# Altium schematic sheet DMB.SchDoc
size Letter
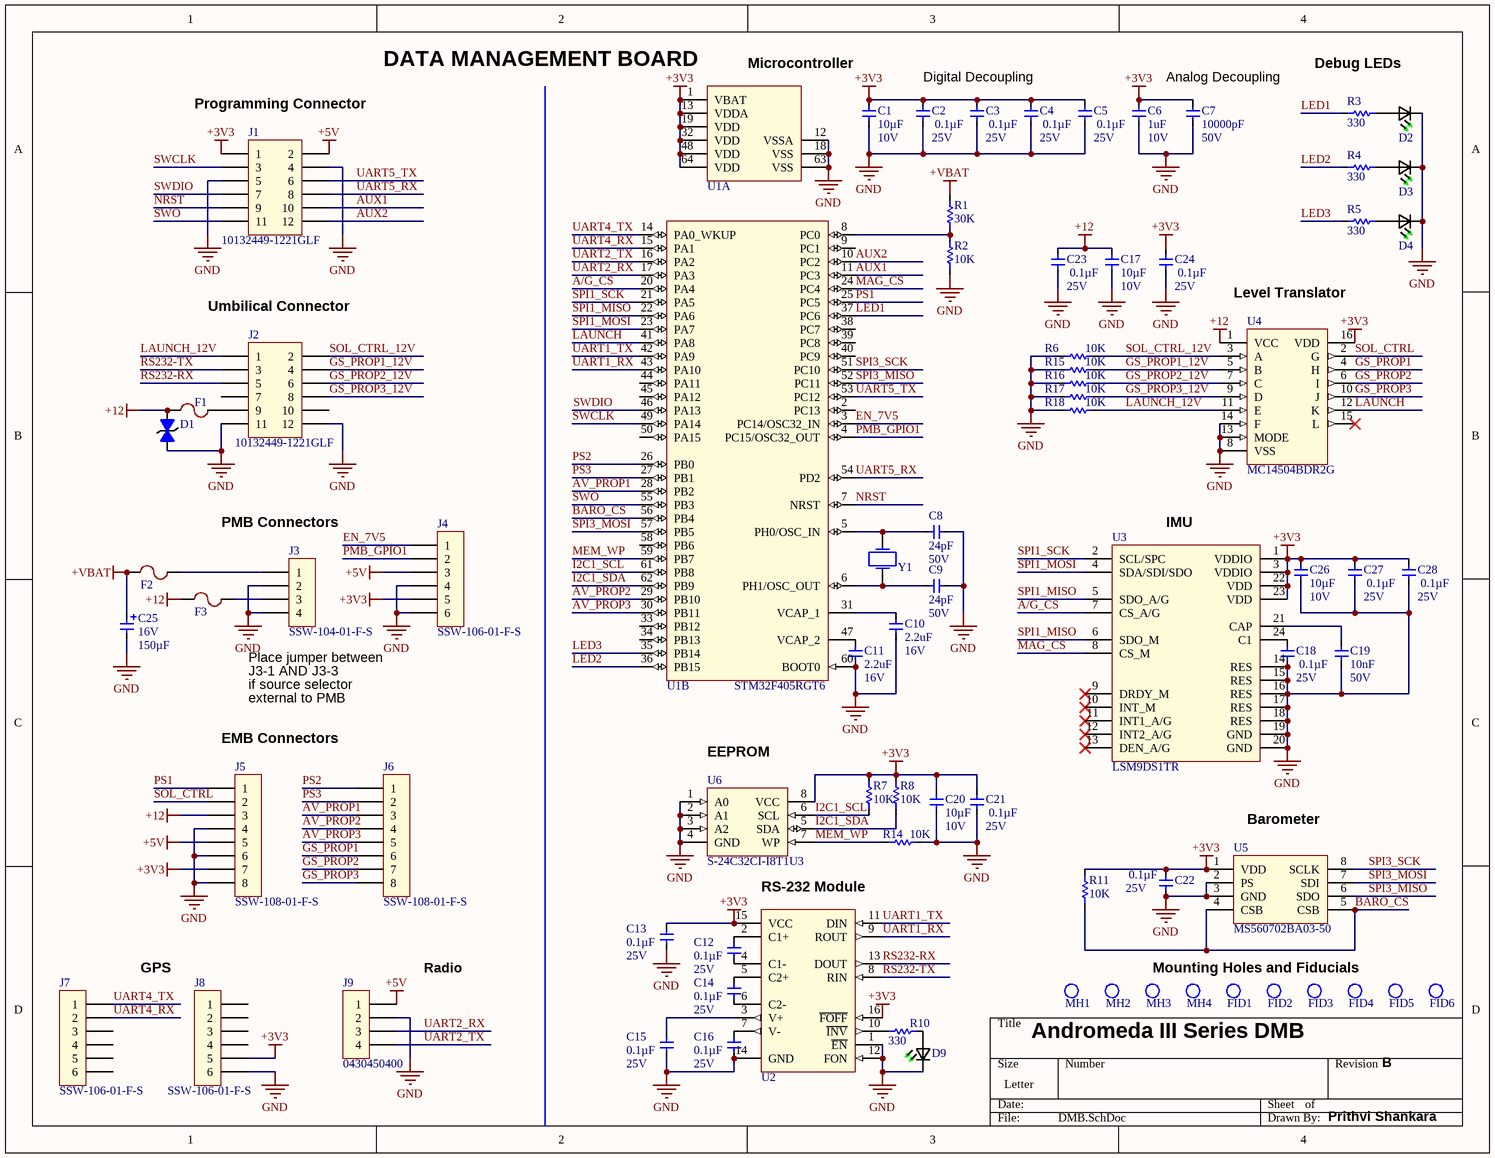
[diagram p0: DMB.SchDoc]

## Parts
C1  Capacitance: 10µF  Voltage - Rated: 10V  [0603[1608]]  (hidden comment: CL10A106MP8NNNC)
C2  Capacitance: 0.1µF  Voltage - Rated: 25V  [0603[1608]]  (hidden comment: CGA3E2X7R1E104K080AA)
C3  Capacitance: 0.1µF  Voltage - Rated: 25V  [0603[1608]]  (hidden comment: CGA3E2X7R1E104K080AA)
C4  Capacitance: 0.1µF  Voltage - Rated: 25V  [0603[1608]]  (hidden comment: CGA3E2X7R1E104K080AA)
C5  Capacitance: 0.1µF  Voltage - Rated: 25V  [0603[1608]]  (hidden comment: CGA3E2X7R1E104K080AA)
C6  Capacitance: 1uF  Voltage - Rated: 10V  [0603[1608]]  (hidden comment: CL10A105KP8NNNC)
C7  Capacitance: 10000pF  Voltage - Rated: 50V  [0603[1608]]  (hidden comment: CGA3E2X7R1H103K080AA)
C8  Capacitance: 24pF  Voltage - Rated: 50V  [0603[1608]]  (hidden comment: 06035A240JAT2A)
C9  Capacitance: 24pF  Voltage - Rated: 50V  [0603[1608]]  (hidden comment: 06035A240JAT2A)
C10  Capacitance: 2.2uF  Voltage - Rated: 16V  [0603[1608]]  (hidden comment: C1608X5R1C225K080AB)
C11  Capacitance: 2.2uF  Voltage - Rated: 16V  [0603[1608]]  (hidden comment: C1608X5R1C225K080AB)
C12  Capacitance: 0.1µF  Voltage - Rated: 25V  [0603[1608]]  (hidden comment: CGA3E2X7R1E104K080AA)
C13  Capacitance: 0.1µF  Voltage - Rated: 25V  [0603[1608]]  (hidden comment: CGA3E2X7R1E104K080AA)
C14  Capacitance: 0.1µF  Voltage - Rated: 25V  [0603[1608]]  (hidden comment: CGA3E2X7R1E104K080AA)
C15  Capacitance: 0.1µF  Voltage - Rated: 25V  [0603[1608]]  (hidden comment: CGA3E2X7R1E104K080AA)
C16  Capacitance: 0.1µF  Voltage - Rated: 25V  [0603[1608]]  (hidden comment: CGA3E2X7R1E104K080AA)
C17  Capacitance: 10µF  Voltage - Rated: 10V  [0603[1608]]  (hidden comment: CL10A106MP8NNNC)
C18  Capacitance: 0.1µF  Voltage - Rated: 25V  [0603[1608]]  (hidden comment: CGA3E2X7R1E104K080AA)
C19  Capacitance: 10nF  Voltage - Rated: 50V  [0603[1608]]  (hidden comment: GRM1885C1H103JA01D)
C20  Capacitance: 10µF  Voltage - Rated: 10V  [0603[1608]]  (hidden comment: CL10A106MP8NNNC)
C21  Capacitance: 0.1µF  Voltage - Rated: 25V  [0603[1608]]  (hidden comment: CGA3E2X7R1E104K080AA)
C22  Capacitance: 0.1µF  Voltage - Rated: 25V  [0603[1608]]  (hidden comment: CGA3E2X7R1E104K080AA)
C23  Capacitance: 0.1µF  Voltage - Rated: 25V  [0603[1608]]  (hidden comment: CGA3E2X7R1E104K080AA)
C24  Capacitance: 0.1µF  Voltage - Rated: 25V  [0603[1608]]  (hidden comment: CGA3E2X7R1E104K080AA)
C25  Voltage - Rated: 16V  Capacitance: 150µF  [TAJD157K016RNJ]  (hidden comment: TAJD157K016RNJ)
C26  Capacitance: 10µF  Voltage - Rated: 10V  [0603[1608]]  (hidden comment: CL10A106MP8NNNC)
C27  Capacitance: 0.1µF  Voltage - Rated: 25V  [0603[1608]]  (hidden comment: CGA3E2X7R1E104K080AA)
C28  Capacitance: 0.1µF  Voltage - Rated: 25V  [0603[1608]]  (hidden comment: CGA3E2X7R1E104K080AA)
D1  CDSOD323-T12C  [CDSOD323-T12C]  (value not drawn)
D2  LTST-C191KGKT  [LTST-C191KGKT]  (value not drawn)
D3  LTST-C191KGKT  [LTST-C191KGKT]  (value not drawn)
D4  LTST-C191KGKT  [LTST-C191KGKT]  (value not drawn)
D9  LTST-C191KGKT  [LTST-C191KGKT]  (value not drawn)
F1  SF-0603FP500M-2  [SF-0603FP500M-2]  (value not drawn)
F2  SF-0603FP500M-2  [SF-0603FP500M-2]  (value not drawn)
F3  SF-0603FP500M-2  [SF-0603FP500M-2]  (value not drawn)
FID1  FID_1MM_ROUND_SL  [FID_1MM_ROUND_SL]  (value not drawn)  (no BOM)
FID2  FID_1MM_ROUND_SL  [FID_1MM_ROUND_SL]  (value not drawn)  (no BOM)
FID3  FID_1MM_ROUND_SL  [FID_1MM_ROUND_SL]  (value not drawn)  (no BOM)
FID4  FID_1MM_ROUND_SL  [FID_1MM_ROUND_SL]  (value not drawn)  (no BOM)
FID5  FID_1MM_ROUND_SL  [FID_1MM_ROUND_SL]  (value not drawn)  (no BOM)
FID6  FID_1MM_ROUND_SL  [FID_1MM_ROUND_SL]  (value not drawn)  (no BOM)
J1  10132449-1221GLF  [10132449-1221GLF]
J2  10132449-1221GLF  [10132449-1221GLF]
J3  SSW-104-01-F-S  [SSW-104-01-F-S]
J4  SSW-106-01-F-S  [SSW-106-01-F-S]
J5  SSW-108-01-F-S  [SSW-108-01-F-S]
J6  SSW-108-01-F-S  [SSW-108-01-F-S]
J7  SSW-106-01-F-S  [SSW-106-01-F-S]
J8  SSW-106-01-F-S  [SSW-106-01-F-S]
J9  0430450400  [0430450400]
MH1  Mounting Hole  [M3X0.5]  (value not drawn)  (no BOM)
MH2  Mounting Hole  [M3X0.5]  (value not drawn)  (no BOM)
MH3  Mounting Hole  [M3X0.5]  (value not drawn)  (no BOM)
MH4  Mounting Hole  [M3X0.5]  (value not drawn)  (no BOM)
R1  Resistance: 30K  [0603[1608]]  (hidden comment: RC0603FR-0730KL)
R2  Resistance: 10K  [0603[1608]]  (hidden comment: ERJ-3GEYJ103V)
R3  Resistance: 330  [0603[1608]]  (hidden comment: RC1608F331CS)
R4  Resistance: 330  [0603[1608]]  (hidden comment: RC1608F331CS)
R5  Resistance: 330  [0603[1608]]  (hidden comment: RC1608F331CS)
R6  Resistance: 10K  [0603[1608]]  (hidden comment: ERJ-3GEYJ103V)
R7  Resistance: 10K  [0603[1608]]  (hidden comment: ERJ-3GEYJ103V)
R8  Resistance: 10K  [0603[1608]]  (hidden comment: ERJ-3GEYJ103V)
R10  Resistance: 330  [0603[1608]]  (hidden comment: RC1608F331CS)
R11  Resistance: 10K  [0603[1608]]  (hidden comment: ERJ-3GEYJ103V)
R14  Resistance: 10K  [0603[1608]]  (hidden comment: ERJ-3GEYJ103V)
R15  Resistance: 10K  [0603[1608]]  (hidden comment: ERJ-3GEYJ103V)
R16  Resistance: 10K  [0603[1608]]  (hidden comment: ERJ-3GEYJ103V)
R17  Resistance: 10K  [0603[1608]]  (hidden comment: ERJ-3GEYJ103V)
R18  Resistance: 10K  [0603[1608]]  (hidden comment: ERJ-3GEYJ103V)
U1  STM32F405RGT6  [TSQFP50P1200X1200X160-64N]  (value not drawn)  (parts A,B of 2)
U2  MAX3221ECPWR  [SOP65P780X200-16N]  (value not drawn)
U3  LSM9DS1TR  [LSM9DS1TR]
U4  MC14504BDR2G  [MC14504BDR2G]
U5  MS560702BA03-50  [MS560702BA03-50]
U6  S-24C32CI-I8T1U3  [SON50P220X50-8N]
Y1  ABLS-8.000MHZ-B2-T  [ABLS-8.000MHZ-B2-T]  (value not drawn)

## Nets
+3V3: C1.2 C2.2 C3.2 C4.2 C5.2 C6.2 C7.2 C13.2 C20.2 C21.2 C22.2 C24.2 C26.2 C27.2 C28.2 J1.1 J4.5 J5.7 J8.5 R7.2 R8.2 R11.2 U1.1(VBAT) U1.13(VDDA) U1.19(VDD) U1.32(VDD) U1.48(VDD) U1.64(VDD) U2.15(VCC) U2.16(~{FOFF}) U3.1(VDDIO) U3.3(VDDIO) U3.22(VDD) U3.23(VDD) U4.16(VDD) U5.1(VDD) U6.8(VCC)
+5V: J1.2 J4.3 J5.5 J9.1
+12: C17.2 C23.2 D1.1 F1.1 F3.1 J5.3 U4.1(VCC)
+VBAT: C25.1 F2.1 R1.2
GND: C1.1 C2.1 C3.1 C4.1 C5.1 C6.1 C7.1 C8.2 C9.2 C10.1 C11.1 C13.1 C15.1 C16.1 C17.1 C18.1 C19.1 C20.1 C21.1 C22.1 C23.1 C24.1 C25.2 C26.1 C27.1 C28.1 D1.2 D2.1(K2) D3.1(K2) D4.1(K2) D9.1(K2) J1.4 J1.5 J2.11 J2.12 J3.2 J3.4 J4.4 J4.6 J5.4 J5.6 J5.8 J8.6 J9.2 R2.1 R6.1 R14.1 R15.1 R16.1 R17.1 R18.1 U1.12(VSSA) U1.18(VSS) U1.60(BOOT0) U1.63(VSS) U2.1(~{EN}) U2.12(FON) U2.14(GND) U3.14(RES) U3.15(RES) U3.16(RES) U3.17(RES) U3.18(RES) U3.19(GND) U3.20(GND) U4.8(VSS) U4.13(MODE) U4.14(F) U5.2(PS) U5.3(GND) U6.1(A0) U6.2(A1) U6.3(A2) U6.4(GND)
A/G_~{CS}: U1.20(PA4) U3.7(CS_A/G)
AUX1: J1.10 U1.11(PC3)
AUX2: J1.12 U1.10(PC2)
AV_PROP1: J6.3 U1.28(PB2)
AV_PROP2: J6.4 U1.29(PB10)
AV_PROP3: J6.5 U1.30(PB11)
BARO_~{CS}: R11.1 U1.56(PB4) U5.4(CSB) U5.5(CSB)
EN_7V5: J4.1 U1.3(PC14/OSC32_IN)
GS_PROP1: J6.6 U4.4(H)
GS_PROP1_12V: J2.4 R15.2 U4.5(B)
GS_PROP2: J6.7 U4.6(I)
GS_PROP2_12V: J2.6 R16.2 U4.7(C)
GS_PROP3: J6.8 U4.10(J)
GS_PROP3_12V: J2.8 R17.2 U4.9(D)
I2C1_SCL: R7.1 U1.61(PB8) U6.6(SCL)
I2C1_SDA: R8.1 U1.62(PB9) U6.5(SDA)
LAUNCH: U1.41(PA8) U4.12(K)
LAUNCH_12V: J2.1 R18.2 U4.11(E)
LED1: R3.2 U1.37(PC6)
LED2: R4.2 U1.36(PB15)
LED3: R5.2 U1.35(PB14)
MAG_~{CS}: U1.24(PC4) U3.8(CS_M)
MEM_WP: R14.2 U1.59(PB7) U6.7(WP)
NRST: J1.9 U1.7(NRST)
PMB_GPIO1: J4.2 U1.4(PC15/OSC32_OUT)
PS1: J5.1 U1.25(PC5)
PS2: J6.1 U1.26(PB0)
PS3: J6.2 U1.27(PB1)
RS232-RX: J2.5 U2.13(DOUT)
RS232-TX: J2.3 U2.8(RIN)
SOL_CTRL: J5.2 U4.2(G)
SOL_CTRL_12V: J2.2 R6.2 U4.3(A)
SPI1_MISO: U1.22(PA6) U3.5(SDO_A/G) U3.6(SDO_M)
SPI1_MOSI: U1.23(PA7) U3.4(SDA/SDI/SDO)
SPI1_SCK: U1.21(PA5) U3.2(SCL/SPC)
SPI3_MISO: U1.52(PC11) U5.6(SDO)
SPI3_MOSI: U1.57(PB5) U5.7(SDI)
SPI3_SCK: U1.51(PC10) U5.8(SCLK)
SWCLK: J1.3 U1.49(PA14)
SWDIO: J1.7 U1.46(PA13)
SWO: J1.11 U1.55(PB3)
UART1_RX: U1.43(PA10) U2.9(ROUT)
UART1_TX: U1.42(PA9) U2.11(DIN)
UART2_RX: J9.3 U1.17(PA3)
UART2_TX: J9.4 U1.16(PA2)
UART4_RX: J7.2 U1.15(PA1)
UART4_TX: J7.1 U1.14(PA0_WKUP)
UART5_RX: J1.8 U1.54(PD2)
UART5_TX: J1.6 U1.53(PC12)
NetC8_1: C8.1 U1.5(PH0/OSC_IN) Y1.2
NetC9_1: C9.1 U1.6(PH1/OSC_OUT) Y1.1
NetC10_2: C10.2 U1.31(VCAP_1)
NetC11_2: C11.2 U1.47(VCAP_2)
NetC12_1: C12.1 U2.4(C1-)
NetC12_2: C12.2 U2.2(C1+)
NetC14_1: C14.1 U2.6(C2-)
NetC14_2: C14.2 U2.5(C2+)
NetC15_2: C15.2 U2.3(V+)
NetC16_2: C16.2 U2.7(V-)
NetC18_2: C18.2 U3.24(C1)
NetC19_2: C19.2 U3.21(CAP)
NetD2_2: D2.2(A2) R3.1
NetD3_2: D3.2(A2) R4.1
NetD4_2: D4.2(A2) R5.1
NetD9_2: D9.2(A2) R10.2
NetF1_2: F1.2 J2.9
NetF2_2: F2.2 J3.1
NetF3_2: F3.2 J3.3
NetR1_1: R1.1 R2.2 U1.8(PC0)
NetR10_1: R10.1 U2.10(~{INV})

Not connected (* = marked no-connect by the designer): J2 7 10; J7 3 4 5 6; J8 1 2 3 4; U1 2(PC13) 9(PC1) 33(PB12) 34(PB13) 38(PC7) 39(PC8) 40(PC9) 44(PA11) 45(PA12) 50(PA15) 58(PB6); U3 9(DRDY_M)* 10(INT_M)* 11(INT1_A/G)* 12(INT2_A/G)* 13(DEN_A/G)*; U4 15(L)*

## Notes on the sheet
- DATA MANAGEMENT BOARD
- Microcontroller
- Digital Decoupling
- Analog Decoupling
- Debug LEDs
- (near J1) Programming Connector
- Level Translator
- (near J2) Umbilical Connector
- (near J3) PMB Connectors
- (near U3) IMU
- Place jumper between
- J3-1 AND J3-3
- if source selector
- external to PMB
- (near J5) EMB Connectors
- (near U6) EEPROM
- Barometer
- RS-232 Module
- GPS
- Radio
- Mounting Holes and Fiducials
- Andromeda III Series DMB
- B
- Prithvi Shankara

## Library data of the parts
C1 C17 C20 C26 = CL10A106MP8NNNC: CAP CER 10UF 10V X5R 0603; Manufacturer: Samsung Electro-Mechanics; Tolerance: ±20%; Temperature Coefficient: X5R; Operating Temperature: -55°C ~ 85°C; Mounting Type: Surface Mount, MLCC; Package / Case: 0603 (1608 Metric); Size / Dimension: 0.063" L x 0.031" W (1.60mm x 0.80mm); Manufacturer Part Number: CL10A106MP8NNNC; Thickness (Max): 0.035" (0.90mm); ComponentLink1Description: Datasheet; ComponentLink1URL: https://static6.arrow.com/aropdfconversion/f91a1722e2705c3d73cfb1979021b64ae4055093/19-cl10a106mp8nnnc.pdf; Supplier 1: Digi-Key; Supplier Part Number 1: 1276-1871-1-ND
C2-C5 C12-C16 C18 C21-C24 C27 C28 = CGA3E2X7R1E104K080AA: CAP CER 0.1UF 25V X7R 0603; Manufacturer: TDK Corporation; Tolerance: ±10%; Temperature Coefficient: X7R; Operating Temperature: -55°C ~ 125°C; Mounting Type: Surface Mount, MLCC; Package / Case: 0603 (1608 Metric); Size / Dimension: 0.063" L x 0.031" W (1.60mm x 0.80mm); Manufacturer Part Number: CGA3E2X7R1E104K080AA; Thickness (Max): 0.035" (0.90mm); ComponentLink1Description: Datasheet; ComponentLink1URL: https://product.tdk.com/info/en/catalog/spec/mlccspec_automotive_general_en.pdf; Supplier 1: Digi-Key; Supplier Part Number 1: 445-5667-1-ND
C6 = CL10A105KP8NNNC: CAP CER 1UF 10V X5R 0603; Manufacturer: Samsung Electro-Mechanics; Tolerance: ±10%; Temperature Coefficient: X5R; Operating Temperature: -55°C ~ 85°C; Mounting Type: Surface Mount, MLCC; Package / Case: 0603 (1608 Metric); Size / Dimension: 0.063" L x 0.031" W (1.60mm x 0.80mm); Manufacturer Part Number: CL10A105KP8NNNC; Thickness (Max): 0.035" (0.90mm); ComponentLink1Description: Datasheet; ComponentLink1URL: http://www.samsungsem.com/kr/support/product-search/mlcc/__icsFiles/afieldfile/2019/05/10/19-CL10A105KP8NNNC.pdf; Supplier 1: Digi-Key; Supplier Part Number 1: 1276-1182-1-ND
C7 = CGA3E2X7R1H103K080AA: CAP CER 10000PF 50V X7R 0603; Manufacturer: TDK Corporation; Tolerance: ±10%; Temperature Coefficient: X7R; Operating Temperature: -55°C ~ 125°C; Mounting Type: Surface Mount, MLCC; Package / Case: 0603 (1608 Metric); Size / Dimension: 0.063" L x 0.031" W (1.60mm x 0.80mm); Manufacturer Part Number: CGA3E2X7R1H103K080AA; Thickness (Max): 0.035" (0.90mm); ComponentLink1Description: Datasheet; ComponentLink1URL: https://product.tdk.com/info/en/catalog/spec/mlccspec_automotive_general_en.pdf; Supplier 1: Digi-Key; Supplier Part Number 1: 445-5662-1-ND
C8 C9 = 06035A240JAT2A: CAP CER 24PF 50V NP0 0603; Manufacturer: AVX Corporation; Tolerance: ±5%; Temperature Coefficient: C0G, NP0; Operating Temperature: -55°C ~ 125°C; Mounting Type: Surface Mount, MLCC; Package / Case: 0603 (1608 Metric); Size / Dimension: 0.063" L x 0.032" W (1.60mm x 0.81mm); Manufacturer Part Number: 06035A240JAT2A; Thickness (Max): 0.035" (0.90mm); ComponentLink1Description: Datasheet; ComponentLink1URL: http://datasheets.avx.com/C0GNP0-Dielectric.pdf; Supplier 1: Digi-Key; Supplier Part Number 1: 478-10304-1-ND
C10 C11 = C1608X5R1C225K080AB: CAP CER 2.2UF 16V X5R 0603; Manufacturer: TDK Corporation; Tolerance: ±10%; Temperature Coefficient: X5R; Operating Temperature: -55°C ~ 85°C; Mounting Type: Surface Mount, MLCC; Package / Case: 0603 (1608 Metric); Size / Dimension: 0.063" L x 0.031" W (1.60mm x 0.80mm); Manufacturer Part Number: C1608X5R1C225K080AB; Thickness (Max): 0.035" (0.90mm); ComponentLink1Description: Datasheet; ComponentLink1URL: https://product.tdk.com/info/en/catalog/spec/mlccspec_commercial_general_midvoltage_en.pdf; Supplier 1: Digi-Key; Supplier Part Number 1: 445-5157-1-ND
C19 = GRM1885C1H103JA01D: CAP CER 10000PF 50V C0G/NP0 0603; Manufacturer: Murata Electronics; Tolerance: ±50%; Temperature Coefficient: C0G, NP0; Operating Temperature: -55°C ~ 125°C; Mounting Type: Surface Mount, MLCC; Package / Case: 0603 (1608 Metric); Size / Dimension: 0.063" L x 0.031" W (1.60mm x 0.80mm); Manufacturer Part Number: GRM1885C1H103JA01D; Thickness (Max): 0.035" (0.90mm); ComponentLink1Description: Datasheet; ComponentLink1URL: https://www.murata.com/~/media/webrenewal/support/library/catalog/products/capacitor/mlcc/c02e.ashx?la=en-us; Supplier 1: Digi-Key; Supplier Part Number 1: 490-9666-1-ND
C25 = TAJD157K016RNJ: CAP TANT 150UF 10% 16V 2917; Manufacturer: AVX Corporation; Manufacturer Size Code: D; Type: Molded; ESR: 900mOhm; Tolerance: ±10%; Operating Temperature: -55°C ~ 125°C; Mounting Type: Surface Mount; Package / Case: 2917 (7343 Metric); Manufacturer Part Number: TAJD157K016RNJ; Size / Dimension: 0.287" L x 0.169" W (7.30mm x 4.30mm); Height - Seated (Max): 0.122" (3.10mm); ComponentLink1Description: Datasheet; ComponentLink1URL: http://datasheets.avx.com/TAJ.pdf; Supplier 1: Digi-Key; Supplier Part Number 1: 478-2356-1-ND
D1 = CDSOD323-T12C: TVS DIODE 12V 28.3V SOD323; ComponentLink1Description: Datasheet; ComponentLink1URL: https://www.bourns.com/docs/Product-Datasheets/CDSOD323-TxxC.PDF
D2-D4 D9 = LTST-C191KGKT: LED GREEN CLEAR SMD 0603; Manufacturer: Lite-On Inc.; Lens Color: Colourless; Millicandela Rating: 35mcd; Lens Style: Rectangle with Flat Top; Lens Size: 1.10mm x 0.80mm; Voltage - Forward (Vf) (Typ): 2V; Current - Test: 20mA; Viewing Angle: 130°; Wavelength - Dominant: 571nm; Wavelength - Peak: 574nm; ComponentLink1Description: Datasheet; ComponentLink1URL: http://optoelectronics.liteon.com/upload/download/DS22-2000-228/LTST-C191KGKT.PDF; Manufacturer Part Number: LTST-C191KGKT; Colour: Green; Lens Transparency: Clear; Mounting Type: Surface Mount; Package / Case: 0603 (1608 Metric); Size / Dimension: 1.60mm L x 0.80mm W; Height (Max): 0.65mm; Supplier 1: Digi-Key; Supplier Part Number 1: 160-1446-1-ND
F1-F3 = SF-0603FP500M-2: FUSE BOARD MOUNT 5A 32VDC 0603; Manufacturer: Bourns Inc.; Response Time: Fast Blow; Breaking Capacity @ Rated Voltage: 35A; Melting I²t: 2.62; Approval Agency: UL; DC Cold Resistance: 0.015 Ohms; Fuse Type: Board Mount (Cartridge Style Excluded); Voltage Rating - DC: 32V; ComponentLink1Description: Datasheet; ComponentLink1URL: https://www.bourns.com/docs/Product-Datasheets/SF-0603FPxxxM.pdf; Manufacturer Part Number: SF-0603FP500M-2; Mounting Type: Surface Mount; Package / Case: 0603 (1608 Metric); Operating Temperature: -55°C ~ 150°C; Size / Dimension: 0.063" L x 0.031" W x 0.012" H (1.60mm x 0.80mm x 0.18mm); Current Rating (Amps): 5A; Supplier 1: Digi-Key; Supplier Part Number 1: SF-0603FP500M-2CT-ND
FID1-FID6 = FID_1MM_ROUND_SL: Fiducial 1mm Round Single Layer
J1 J2 = 10132449-1221GLF: CONN HEADER R/A 12POS 3MM; Manufacturer: Amphenol ICC (FCI); Pitch - Mating: 0.118" (3.00mm); Number of Positions: 12; Number of Positions Loaded: All; Style: Board to Cable/Wire; Shrouding: Shrouded - 4 Wall; Contact Length - Post: 0.126" (3.20mm); Material Flammability Rating: UL94 V-0; Voltage Rating: 250V; ComponentLink1Description: Datasheet; ComponentLink1URL: https://cdn.amphenol-icc.com/media/wysiwyg/files/documentation/datasheet/boardwiretoboard/bwb_minitekpwr3.0_hcc.pdf?__cf_chl_jschl_tk__=5b50c337d7977d3136f5a7e9c1a5138446a86722-1578191481-0-AdRe7fXYrldvOZ_oqyXIDS1Fw-yIkYCF-QCdaR8gv5bvudzwMePuF1OnY_qX9R1SRbUtnU8KyfMeQWvo-tgbYDs0UY0fEf2VYly7RnE44wN6RCRwe79pwwTkwB-vrp_E3FFt_m8Gv1l0VQgfDvqJJh9NWsFdXN6uiHYgEWJHQlxni9pgO_Rgu9b74Q_adNTuUPkDts4F_sjwuXFS2gwZ4qhDRVIbOsJk9z2IFwtIQbJe2Vjr12REDPUJnSIFI5L_m3PVR56FMV99EE0fexLx9E4Xzm8z4yXY4QuL_nxicuZLnFM8rKw84cv6VQDtrcv1h8b5URSWpnxkbKmN-6xqBT_N2gwuiomQytubllip4AB4QtXNO4uZy8p0Kaq8ZXDsS9f0XOGpGrNCvURFRCr5YrB2nakG2mZwStZMD_Rr-W-x1kEQ5VT0_Uar3vHfURsPPw; ComponentLink2Description: Drawing; ComponentLink2URL: https://cdn.amphenol-icc.com/media/wysiwyg/files/drawing/10132449.pdf?__cf_chl_jschl_tk__=3fb7538f61705fd3db72d6547b71e22025aaeae6-1578191484-0-ARZmBU2d2iTfwOyvkDW6juGvz8Wa7jPk-lPTAGC3bi6AwA2PAOw_83XbqimUoaj63c73oghkBl5EBlxfVnJt5FnKIy9_Ampqry6wpxN3P9yFfGzzu2bzrkjXc8H98cNGfE4yNZOx4lVYAc0DYF8iUgUBt3ot3PAqRWTuL_OE0dIKXvMd7u_4fU7igR1oB3QBFAu564mexcV1Dg4phJ9BA4kHFs6CIC10MmA2ZlPsaDWmfr6ivcYRarJOnVBN46Piz5s9Rafd2OkXuSIM4yJjlli4dKOItRDrJD3hRC0iA9RVgXipc9Ibd3Qny2RaW6xQiV-dovtBkpyFUGJQUyK5Difre6fQiv59Vrr2PfvD74WBgrERIBaIQ4JCRXFCC0XHSA; Supplier 1: Digi-Key; Supplier Part Number 1: 609-5289-ND; Contact Type: Male Pin; Number of Rows: 2; Row Spacing - Mating: 0.118" (3.00mm); Mounting Type: Through Hole, Right Angle; Termination: Solder; Fastening Type: Locking Ramp; Insulation Height: 0.343" (8.71mm); Contact Shape: Square; Contact Finish - Mating: Tin; Contact Finish - Post: Tin; Contact Material: Copper Alloy; Insulation Material: Polyamide (PA9T), Nylon 9T; Features: Board Lock, Glow Wire Compliant; Operating Temperature: -40°C ~ 105°C; Insulation Color: Black; Manufacturer Part Number: 10132449-1221GLF
J3 = SSW-104-01-F-S: CONN RCPT 4POS FEMALE 0.1 GOLD PCB; Manufacturer: Samtec Inc.; Connector Type: Receptacle; Style: Board to Board or Cable; Number of Positions: 4; Pitch - Mating: 0.100" (2.54mm); Contact Length - Post: 0.104" (2.64mm); Material Flammability Rating: UL94 V-0; Current Rating (Amps): 5.7A per Contact; ComponentLink1Description: Drawing; ComponentLink1URL: http://suddendocs.samtec.com/prints/ssw-1xx-xx-xxx-x-xx-xxx-xx-mkt.pdf; ComponentLink2Description: Datasheet; ComponentLink2URL: http://suddendocs.samtec.com/catalog_english/ssw_th.pdf; Manufacturer Part Number: SSW-104-01-F-S; Contact Type: Forked; Number of Rows: 1; Mounting Type: Through Hole; Termination: Solder; Fastening Type: Push-Pull; Contact Finish - Mating: Gold; Contact Finish Thickness - Mating: 3.00µin (0.076µm); Insulation Color: Black; Insulation Height: 0.335" (8.51mm); Operating Temperature: -55°C ~ 125°C; Contact Finish - Post: Tin; Insulation Material: Liquid Crystal Polymer (LCP); Contact Shape: Square; Contact Material: Phosphor Bronze; Supplier 1: Digi-Key; Supplier Part Number 1: SAM10018-ND
J4 J7 J8 = SSW-106-01-F-S: CONN RCPT 6POS FEMALE 0.1 GOLD PCB; Manufacturer: Samtec Inc.; Connector Type: Receptacle; Style: Board to Board or Cable; Number of Positions: 6; Pitch - Mating: 0.100" (2.54mm); Contact Length - Post: 0.104" (2.64mm); Material Flammability Rating: UL94 V-0; Current Rating (Amps): 5.7A per Contact; ComponentLink1Description: Drawing; ComponentLink1URL: http://suddendocs.samtec.com/prints/ssw-1xx-xx-xxx-x-xx-xxx-xx-mkt.pdf; ComponentLink2Description: Datasheet; ComponentLink2URL: http://suddendocs.samtec.com/catalog_english/ssw_th.pdf; Manufacturer Part Number: SSW-106-01-F-S; Contact Type: Forked; Number of Rows: 1; Mounting Type: Through Hole; Termination: Solder; Fastening Type: Push-Pull; Contact Finish - Mating: Gold; Contact Finish Thickness - Mating: 3.00µin (0.076µm); Insulation Color: Black; Insulation Height: 0.335" (8.51mm); Operating Temperature: -55°C ~ 125°C; Contact Finish - Post: Tin; Insulation Material: Liquid Crystal Polymer (LCP); Contact Shape: Square; Contact Material: Phosphor Bronze; Supplier 1: Digi-Key; Supplier Part Number 1: SAM10025-ND
J5 J6 = SSW-108-01-F-S: CONN RCPT 8POS FEMALE 0.1 GOLD PCB; Manufacturer: Samtec Inc.; Connector Type: Receptacle; Style: Board to Board or Cable; Number of Positions: 8; Pitch - Mating: 0.100" (2.54mm); Contact Length - Post: 0.104" (2.64mm); Material Flammability Rating: UL94 V-0; Current Rating (Amps): 5.7A per Contact; ComponentLink1Description: Drawing; ComponentLink1URL: http://suddendocs.samtec.com/prints/ssw-1xx-xx-xxx-x-xx-xxx-xx-mkt.pdf; ComponentLink2Description: Datasheet; ComponentLink2URL: http://suddendocs.samtec.com/catalog_english/ssw_th.pdf; Manufacturer Part Number: SSW-108-01-F-S; Contact Type: Forked; Number of Rows: 1; Mounting Type: Through Hole; Termination: Solder; Fastening Type: Push-Pull; Contact Finish - Mating: Gold; Contact Finish Thickness - Mating: 3.00µin (0.076µm); Insulation Color: Black; Insulation Height: 0.335" (8.51mm); Operating Temperature: -55°C ~ 125°C; Contact Finish - Post: Tin; Insulation Material: Liquid Crystal Polymer (LCP); Contact Shape: Square; Contact Material: Phosphor Bronze; Supplier 1: Digi-Key; Supplier Part Number 1: SAM11943-ND
J9 = 0430450400: CONN HEADER R/A 4POS 3MM; Manufacturer: Molex; Number of Positions: 4; Row Spacing - Mating: 0.118" (3.00mm); Shrouding: Shrouded - 4 Wall; Contact Length - Post: 0.125" (3.18mm); Material Flammability Rating: UL94 V-0; Current Rating (Amps): 8A; Voltage Rating: 600V; ComponentLink1Description: Drawing; ComponentLink1URL: https://www.molex.com/pdm_docs/sd/430450400_sd.pdf; ComponentLink2Description: Product Specification; ComponentLink2URL: https://www.molex.com/pdm_docs/ps/PS-43045.pdf; Manufacturer Part Number: 0430450400; Contact Type: 0.118" (3.00mm); Number of Rows: 2; Mounting Type: Through Hole, Right Angle; Termination: Solder; Fastening Type: Locking Ramp; Insulation Height: 0.290" (7.37mm); Contact Shape: Square; Contact Finish - Mating: Tin; Contact Finish Thickness - Mating: 100.0µin (2.54µm); Contact Finish - Post: Tin; Contact Material: Brass; Insulation Material: Liquid Crystal Polymer (LCP), Glass Filled; Features: Board Lock; Insulation Color: Black; Supplier 1: Digi-Key; Supplier Part Number 1: WM1814-ND
MH1-MH4 = Mounting Hole: Mounting Hole - Select Footprint
R1 = RC0603FR-0730KL: RES SMD 30K OHM 1% 1/10W 0603; Manufacturer: Yageo; Power  (W): 0.1W; Temperature Coefficient: ±100ppm/°C; Package: 0603 (1608 Metric); Tolerance: ±1%; Operating Temperature: -55°C ~ 155°C; Composition: Thick Film; Manufacturer Part Number: RC0603FR-0730KL; ComponentLink1Description: Datasheet; ComponentLink1URL: https://www.yageo.com/upload/media/product/productsearch/datasheet/rchip/PYu-RC_Group_51_RoHS_L_10.pdf; Supplier 1: Digi-Key; Supplier Part Number 1: 311-30.0KHRCT-ND
R2 R6-R8 R11 R14-R18 = ERJ-3GEYJ103V: RES SMD 10K OHM 5% 1/10W 0603; Manufacturer: Panasonic Electronic Components; Power  (W): 0.1W; Temperature Coefficient: ±200ppm/°C; Package: 0603 (1608 Metric); Tolerance: ±5%; Operating Temperature: -55°C ~ 155°C; Composition: Thick Film; Manufacturer Part Number: ERJ-3GEYJ103V; ComponentLink1Description: Datasheet; Supplier 1: Digi-Key; Supplier Part Number 1: P10KGCT-ND
  R2 R11: ComponentLink1URL: http://www.yageo.com/documents/recent/PYu-RC_Group_51_RoHS_L_9.pdf
  R6-R8 R14-R18: ComponentLink1URL: https://industrial.panasonic.com/cdbs/www-data/pdf/RDA0000/DMA0000COL11.pdf; ComponentLink2Description: Land Pattern; ComponentLink2URL: https://industrial.panasonic.com/cdbs/www-data/pdf/RDA0000/DMA0000COL17.pdf
R3-R5 R10 = RC1608F331CS: RES SMD 330 OHM 1% 1/10W 0603; Manufacturer: Samsung Electro-Mechanics; Power  (W): 0.1W; Temperature Coefficient: ±100ppm/°C; Package: 0603 (1608 Metric); Tolerance: ±1%; Operating Temperature: -55°C ~ 155°C; Composition: Thick Film; Manufacturer Part Number: RC1608F331CS; ComponentLink1Description: Datasheet; ComponentLink1URL: http://www.samsungsem.com/kr/support/product-search/chip-resistor/__icsFiles/afieldfile/2019/01/21/RC_Spec_Sheet(1901).pdf; Supplier 1: Digi-Key; Supplier Part Number 1: 1276-4604-2-ND
U1 = STM32F405RGT6: IC MCU 32BIT 1MB FLASH 64LQFP; Manufacturer: STMicroelectronics; Core Processor: ARM® Cortex®-M4; Core Size: 32-Bit; Speed: 168MHz; Connectivity: CANbus, I²C, IrDA, LINbus, SPI, UART/USART, USB OTG; Peripherals: Brown-out Detect/Reset, DMA, I²S, LCD, POR, PWM, WDT; Number of I/O: 51; Program Memory Size: 1MB (1M x 8); RAM Size: 192K x 8; Voltage - Supply (VDD): 1.8V ~ 3.6V; Data Converters: A/D 16x12b; D/A 2x12b; Oscillator Type: Internal; ComponentLink1Description: Datasheet; ComponentLink1URL: https://www.st.com/content/ccc/resource/technical/document/datasheet/ef/92/76/6d/bb/c2/4f/f7/DM00037051.pdf/files/DM00037051.pdf/jcr:content/translations/en.DM00037051.pdf; Program Memory Type: FLASH; Manufacturer Part Number: STM32F405RGT6; Operating Temperature: -40°C ~ 85°C (TA); Mounting Type: Surface Mount; Package / Case: 64-LQFP; Supplier 1: Digi-Key; Supplier Part Number 1: 497-11767-ND
U2 = MAX3221ECPWR: IC TRANSCEIVER FULL 1/1 16TSSOP; Manufacturer: Texas Instruments; Protocol: RS232; Receiver Hysteresis: 500mV; Data Rate: 250kbps; Voltage - Supply: 3V ~ 5.5V; ComponentLink1Description: Datasheet; ComponentLink1URL: http://www.ti.com/lit/ds/symlink/max3221e.pdf; Supplier 1: Digi-Key; Supplier Part Number 1: 296-19825-2-ND; Manufacturer Part Number: MAX3221ECPWR; Type: Transceiver; Number of Drivers/Receivers: 1/1; Duplex: Full; Operating Temperature: 0°C ~ 70°C; Mounting Type: Surface Mount; Package / Case: 16-TSSOP (0.173", 4.40mm Width); Supplier Device Package: 16-TSSOP; Base Part Number: MAX3221E
U3 = LSM9DS1TR: IMU ACCEL/GYRO/MAG I2C/SPI 24LGA; Manufacturer: STMicroelectronics; Sensor Type: Accelerometer, Gyroscope, Magnetometer, Temperature, 9 Axis; Output Type: I²C, SPI; ComponentLink1Description: Datasheet; ComponentLink1URL: https://www.st.com/content/ccc/resource/technical/document/datasheet/1e/3f/2a/d6/25/eb/48/46/DM00103319.pdf/files/DM00103319.pdf/jcr:content/translations/en.DM00103319.pdf; Supplier 1: Digi-Key; Supplier Part Number 1: 497-14946-1-ND; Operating Temperature: -40°C ~ 85°C (TA); Package / Case: 24-TFLGA Module; Supplier Device Package: 24-LGA (3x3.5); Mounting Type: Surface Mount; Manufacturer Part Number: LSM9DS1TR
U4 = MC14504BDR2G: IC TRNSLTR UNIDIRECTIONAL 16SOIC; Manufacturer: ON Semiconductor; Manufacturer Part Number: MC14504BDR2G; ComponentLink1Description: Datasheet; ComponentLink1URL: https://www.onsemi.com/pub/Collateral/MC14504B-D.PDF; Supplier 1: Digi-Key; Supplier Part Number 1: MC14504BDR2GOSCT-ND
U5 = MS560702BA03-50: BAROMETRIC PRESSURE SENSOR; Manufacturer: TE Connectivity Measurement Specialties; Pressure Type: Absolute; Operating Pressure: 0.15PSI ~ 17.4PSI (1kPa ~ 120kPa); Output Type: I²C, SPI; Output: 24 b; Accuracy: ±0.022PSI (±0.15kPa); Voltage - Supply: 1.8V ~ 3.6V; Maximum Pressure: 87.02PSI (600kPa); Digi-Key Part Number: 223-1198-1-ND; Manufacturer Part Number: MS560702BA03-50; Termination Style: SMD (SMT) Tab; Operating Temperature: -40°C ~ 85°C; Package / Case: 8-SMD; ComponentLink1Description: Datasheet; ComponentLink1URL: https://www.te.com/commerce/DocumentDelivery/DDEController?Action=srchrtrv&DocNm=MS5607-02BA03&DocType=Data+Sheet&DocLang=English; Supplier 1: Digi-Key; Supplier Part Number 1: 223-1198-1-ND
U6 = S-24C32CI-I8T1U3: IC EEPROM 32K I2C 400KHZ SNT8A; Manufacturer: ABLIC U.S.A. Inc.; Memory Type: Non-Volatile; Memory Size: 32Kb (4K x 8); Memory Interface: I²C; Write Cycle Time - Word, Page: 5ms; Voltage - Supply: 1.6V ~ 5.5V; Access Time: 900ns; Supplier 1: Digi-Key; Supplier Part Number 1: S-24C32CI-I8T1U3-ND; Manufacturer Product Number: S-24C32CI-I8T1U3; Memory Format: EEPROM; Operating Temperature: -40°C ~ 85°C (TA); Mounting Type: Surface Mount; Package / Case: 8-SMD, Flat Lead; Supplier Device Package: SNT-8A; Clock Frequency: 400kHz; ComponentLink1Description: Datasheet; ComponentLink1URL: https://www.ablic.com/en/doc/datasheet/serial_eeprom/S24C32C_64C_E.pdf
Y1 = ABLS-8.000MHZ-B2-T: CRYSTAL 8.0000MHZ 18PF SMD; Manufacturer: Abracon LLC; Frequency Stability: ±50ppm; Frequency Tolerance: ±20ppm; ESR (Equivalent Series Resistance): 80 Ohms; Operating Mode: Fundamental; Supplier 1: Digi-Key; Series: ABLS; Packaging: Cut Tape(CT); Type: MHz Crystal; Load Capacitance: 18pF; Operating Temperature: -20°C ~ 70°C; Mounting Type: Surface Mount; Package/Case: HC-49/US; Size / Dimension: 0.449" L x 0.185" W (11.40mm x 4.70mm); Height - Seated (Max): 0.165" (4.20mm); Supplier Part Number 1: 535-9089-1-ND; ComponentLink1Description: Datasheet; ComponentLink1URL: https://abracon.com/Resonators/abls.pdf; ComponentLink2Description: Drawing; ComponentLink2URL: https://abracon.com/Support/PackageDrawing/Resonators/ABLS-2D.pdf